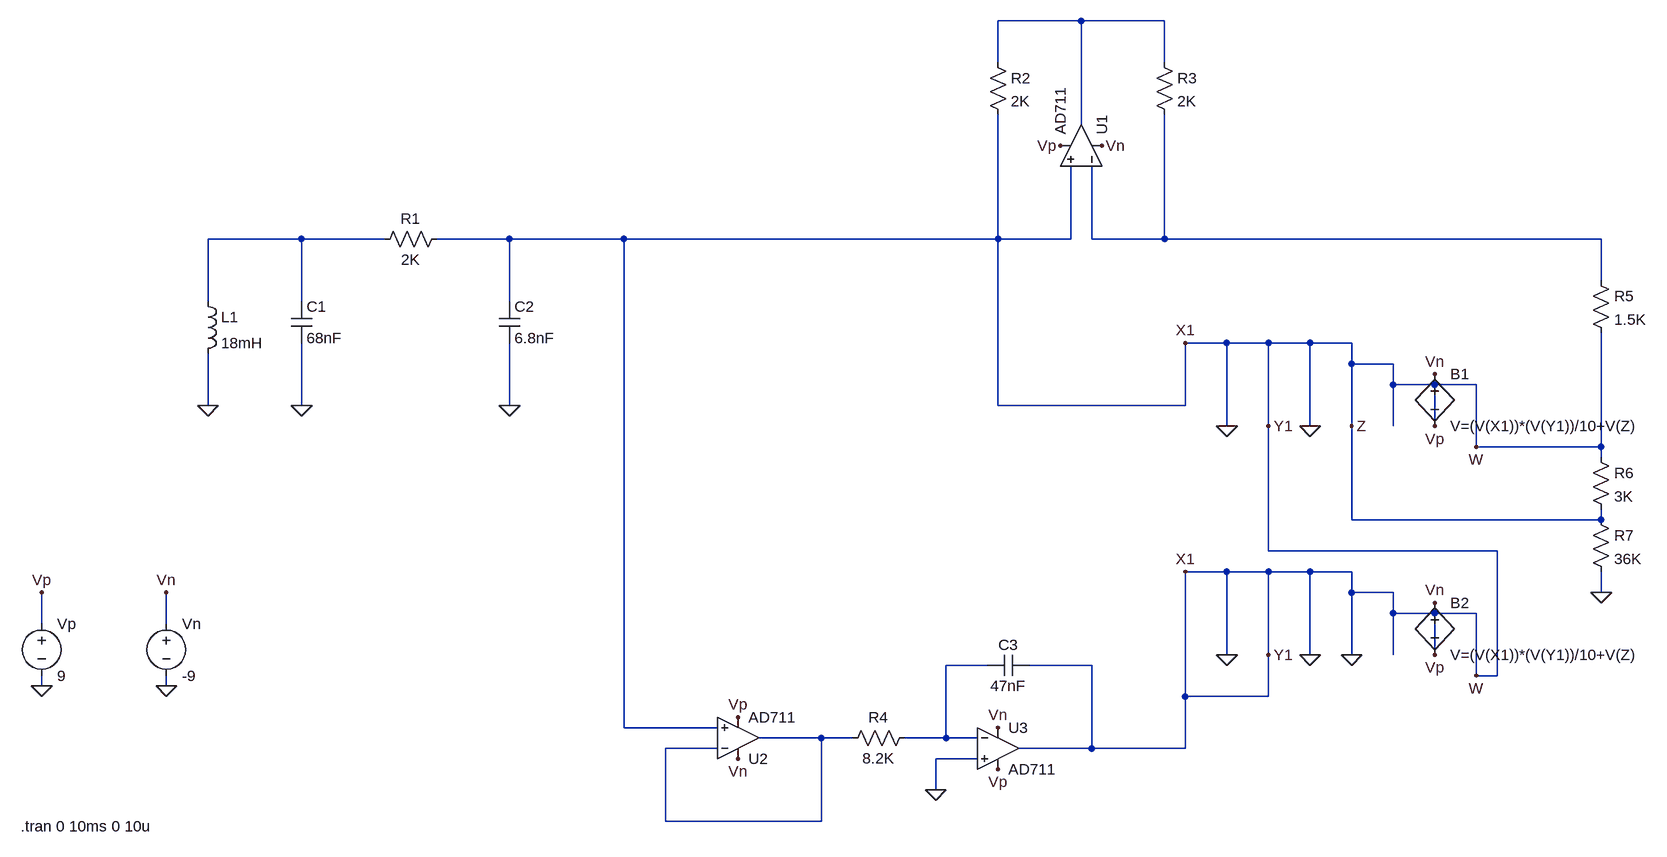
[diagram p0: schematic AD633_behavioral_model.asc]
AD633_behavioral_model.asc, the LTspice schematic file:
Version 4.1
SHEET 1 1216 1212
WIRE 160 -128 32 -128
WIRE 288 -128 160 -128
WIRE 32 -64 32 -128
WIRE 288 -64 288 -128
WIRE 160 32 160 -128
WIRE -1040 208 -1184 208
WIRE -912 208 -1040 208
WIRE -720 208 -832 208
WIRE -544 208 -720 208
WIRE 32 208 32 16
WIRE 32 208 -544 208
WIRE 144 208 144 96
WIRE 144 208 32 208
WIRE 176 208 176 96
WIRE 288 208 288 16
WIRE 288 208 176 208
WIRE 960 208 288 208
WIRE 960 272 960 208
WIRE -1184 304 -1184 208
WIRE -1040 304 -1040 208
WIRE -720 304 -720 208
WIRE 384 368 320 368
WIRE 448 368 384 368
WIRE 512 368 448 368
WIRE 576 368 512 368
WIRE 576 400 576 368
WIRE 640 400 576 400
WIRE 640 432 640 400
WIRE 704 432 640 432
WIRE 768 432 704 432
WIRE -1184 464 -1184 384
WIRE -1040 464 -1040 368
WIRE -720 464 -720 368
WIRE 32 464 32 208
WIRE 320 464 320 368
WIRE 320 464 32 464
WIRE 384 496 384 368
WIRE 448 496 448 368
WIRE 512 496 512 368
WIRE 576 496 576 400
WIRE 640 496 640 432
WIRE 704 496 704 432
WIRE 768 528 768 432
WIRE 960 528 960 352
WIRE 960 528 768 528
WIRE 960 544 960 528
WIRE 576 640 576 496
WIRE 960 640 960 624
WIRE 960 640 576 640
WIRE 448 688 448 496
WIRE 800 688 448 688
WIRE 384 720 320 720
WIRE 448 720 384 720
WIRE 512 720 448 720
WIRE 576 720 512 720
WIRE 576 752 576 720
WIRE 640 752 576 752
WIRE 960 752 960 720
WIRE 640 784 640 752
WIRE 704 784 640 784
WIRE 768 784 704 784
WIRE -1440 800 -1440 752
WIRE -1248 800 -1248 752
WIRE 384 848 384 720
WIRE 448 848 448 720
WIRE 512 848 512 720
WIRE 576 848 576 752
WIRE 640 848 640 784
WIRE 704 848 704 784
WIRE 16 864 -48 864
WIRE 176 864 80 864
WIRE 768 880 768 784
WIRE 800 880 800 688
WIRE 800 880 768 880
WIRE -1440 896 -1440 880
WIRE -1248 896 -1248 880
WIRE 320 912 320 720
WIRE 448 912 448 848
WIRE 448 912 320 912
WIRE -544 960 -544 208
WIRE -400 960 -544 960
WIRE -240 976 -336 976
WIRE -192 976 -240 976
WIRE -48 976 -48 864
WIRE -48 976 -112 976
WIRE 0 976 -48 976
WIRE -400 992 -480 992
WIRE 176 992 176 864
WIRE 176 992 64 992
WIRE 320 992 320 912
WIRE 320 992 176 992
WIRE 0 1008 -64 1008
WIRE -64 1056 -64 1008
WIRE -480 1104 -480 992
WIRE -240 1104 -240 976
WIRE -240 1104 -480 1104
FLAG 320 368 X1
FLAG 448 496 Y1
FLAG 576 496 Z
FLAG 768 528 W
FLAG 320 720 X1
FLAG 448 848 Y1
FLAG 768 880 W
FLAG 384 848 0
FLAG 512 848 0
FLAG 576 848 0
FLAG 512 496 0
FLAG 960 752 0
FLAG -64 1056 0
FLAG -1184 464 0
FLAG -1040 464 0
FLAG -720 464 0
FLAG -1440 896 0
FLAG -1248 896 0
FLAG -1440 752 Vp
FLAG -368 944 Vp
FLAG 32 1024 Vp
FLAG 128 64 Vp
FLAG -1248 752 Vn
FLAG -368 1008 Vn
FLAG 32 960 Vn
FLAG 192 64 Vn
FLAG 704 416 Vn
FLAG 704 496 Vp
FLAG 704 848 Vp
FLAG 704 768 Vn
FLAG 384 496 0
SYMBOL res -816 192 R90
WINDOW 0 0 56 VBottom 2
WINDOW 3 32 56 VTop 2
SYMATTR InstName R1
SYMATTR Value 2K
SYMBOL cap -1056 304 R0
SYMATTR InstName C1
SYMATTR Value 68nF
SYMBOL cap -736 304 R0
SYMATTR InstName C2
SYMATTR Value 6.8nF
SYMBOL ind -1200 288 R0
SYMATTR InstName L1
SYMATTR Value 18mH
SYMBOL res 16 -80 R0
SYMATTR InstName R2
SYMATTR Value 2K
SYMBOL res 272 -80 R0
SYMATTR InstName R3
SYMATTR Value 2K
SYMBOL OpAmps\\AD711 32 928 R0
SYMATTR InstName U3
SYMBOL cap 80 848 R90
WINDOW 0 0 32 VBottom 2
WINDOW 3 32 32 VTop 2
SYMATTR InstName C3
SYMATTR Value 47nF
SYMBOL res -96 960 R90
WINDOW 0 0 56 VBottom 2
WINDOW 3 32 56 VTop 2
SYMATTR InstName R4
SYMATTR Value 8.2K
SYMBOL bv 704 400 R0
SYMATTR InstName B1
SYMATTR Value V=(V(X1))*(V(Y1))/10+V(Z)
SYMBOL bv 704 752 R0
SYMATTR InstName B2
SYMATTR Value V=(V(X1))*(V(Y1))/10+V(Z)
SYMBOL res 944 256 R0
SYMATTR InstName R5
SYMATTR Value 1.5K
SYMBOL res 944 528 R0
SYMATTR InstName R6
SYMATTR Value 3K
SYMBOL res 944 624 R0
SYMATTR InstName R7
SYMATTR Value 36K
SYMBOL OpAmps\\AD711 -368 1040 M180
SYMATTR InstName U2
SYMBOL OpAmps\\AD711 224 64 M270
SYMATTR InstName U1
SYMBOL voltage -1440 784 R0
WINDOW 123 0 0 Left 0
WINDOW 39 0 0 Left 0
SYMATTR InstName Vp
SYMATTR Value 9
SYMBOL voltage -1248 784 R0
WINDOW 123 0 0 Left 0
WINDOW 39 0 0 Left 0
SYMATTR InstName Vn
SYMATTR Value -9
TEXT -1472 1112 Left 2 !.tran 0 10ms 0 10u

The netlist it stands for:
* AD633_behavioral_model.asc
R1 0 N002 2K
C1 N002 0 68nF
C2 0 0 6.8nF
L1 N002 0 18mH
R2 N001 0 2K
R3 N001 N003 2K
X§U3 0 N004 Vn 0 0 AD712  ; AD711, pins In+ In- V+ V- OUT
C3 0 N004 47nF
R4 N004 N005 8.2K
B1 Vn 0 V=(V(X1))*(V(Y1))/10+V(Z)
B2 Vn 0 V=(V(X1))*(V(Y1))/10+V(Z)
R5 N003 0 1.5K
R6 0 0 3K
R7 0 0 36K
X§U2 0 N005 Vn 0 N005 AD712  ; AD711, pins In+ In- V+ V- OUT
X§U1 0 N003 Vn 0 N001 AD712  ; AD711, pins In+ In- V+ V- OUT
Vp 0 0 9
Vn Vn 0 -9
.tran 0 10ms 0 10u
.lib ADI1.lib
.backanno
.end